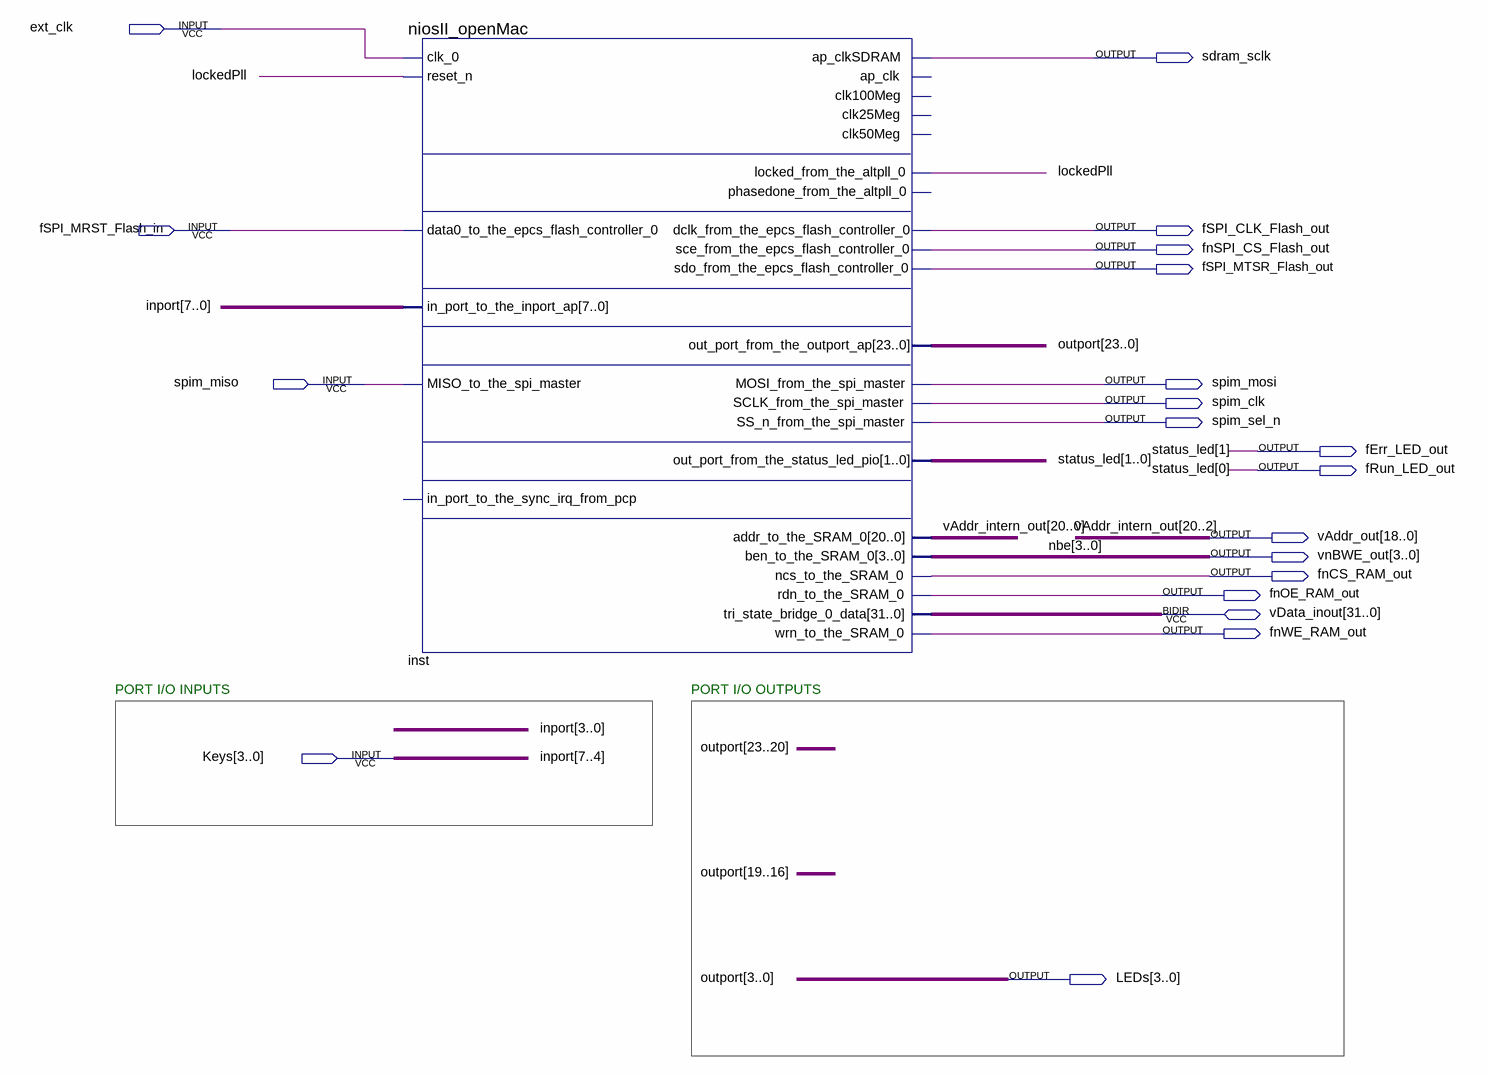
[diagram p0: schematic sheet]
// Quartus schematic nios_pll.bdf as structural Verilog: 1 symbols, 20 pins
module nios_pll (
  input  ext_clk,
  input  fSPI_MRST_Flash_in,
  input  spim_miso,
  input  [3:0] Keys,
  inout  [31:0] vData_inout,
  output sdram_sclk,
  output fSPI_CLK_Flash_out,
  output fnSPI_CS_Flash_out,
  output fSPI_MTSR_Flash_out,
  output spim_mosi,
  output spim_clk,
  output spim_sel_n,
  output fErr_LED_out,
  output fRun_LED_out,
  output [18:0] vAddr_out,
  output [3:0] vnBWE_out,
  output fnCS_RAM_out,
  output fnOE_RAM_out,
  output fnWE_RAM_out,
  output [3:0] LEDs
);

  wire lockedPll;
  wire [1:0] vAddr_intern_out;
  wire [3:0] inport;
  wire [23:4] outport;

  niosII_openMac inst (
    .clk_0(ext_clk), .reset_n(lockedPll), .data0_to_the_epcs_flash_controller_0(fSPI_MRST_Flash_in),
    .in_port_to_the_inport_ap({Keys, inport}), .MISO_to_the_spi_master(spim_miso), .ap_clkSDRAM(sdram_sclk),
    .locked_from_the_altpll_0(lockedPll), .dclk_from_the_epcs_flash_controller_0(fSPI_CLK_Flash_out),
    .sce_from_the_epcs_flash_controller_0(fnSPI_CS_Flash_out),
    .sdo_from_the_epcs_flash_controller_0(fSPI_MTSR_Flash_out),
    .out_port_from_the_outport_ap({outport, LEDs}), .MOSI_from_the_spi_master(spim_mosi),
    .SCLK_from_the_spi_master(spim_clk), .SS_n_from_the_spi_master(spim_sel_n),
    .out_port_from_the_status_led_pio({fErr_LED_out, fRun_LED_out}),
    .addr_to_the_SRAM_0({vAddr_out, vAddr_intern_out}), .ben_to_the_SRAM_0(vnBWE_out),
    .ncs_to_the_SRAM_0(fnCS_RAM_out), .rdn_to_the_SRAM_0(fnOE_RAM_out), .wrn_to_the_SRAM_0(fnWE_RAM_out),
    .tri_state_bridge_0_data(vData_inout));  // open: in_port_to_the_sync_irq_from_pcp, ap_clk, clk100Meg, clk25Meg, clk50Meg, phasedone_from_the_altpll_0

  // Other names for the same wires on the sheet: inport[7:4] = Keys; nbe[3:0] = vnBWE_out; outport[3:0] = LEDs;
  //   status_led[1:0] = {fErr_LED_out, fRun_LED_out}; vAddr_intern_out[20:2] = vAddr_out

  // Notes on the sheet:
  //   PORT I/O INPUTS
  //   PORT I/O OUTPUTS
endmodule
